# Altium project Power_Board_DRV8323.PrjPcb
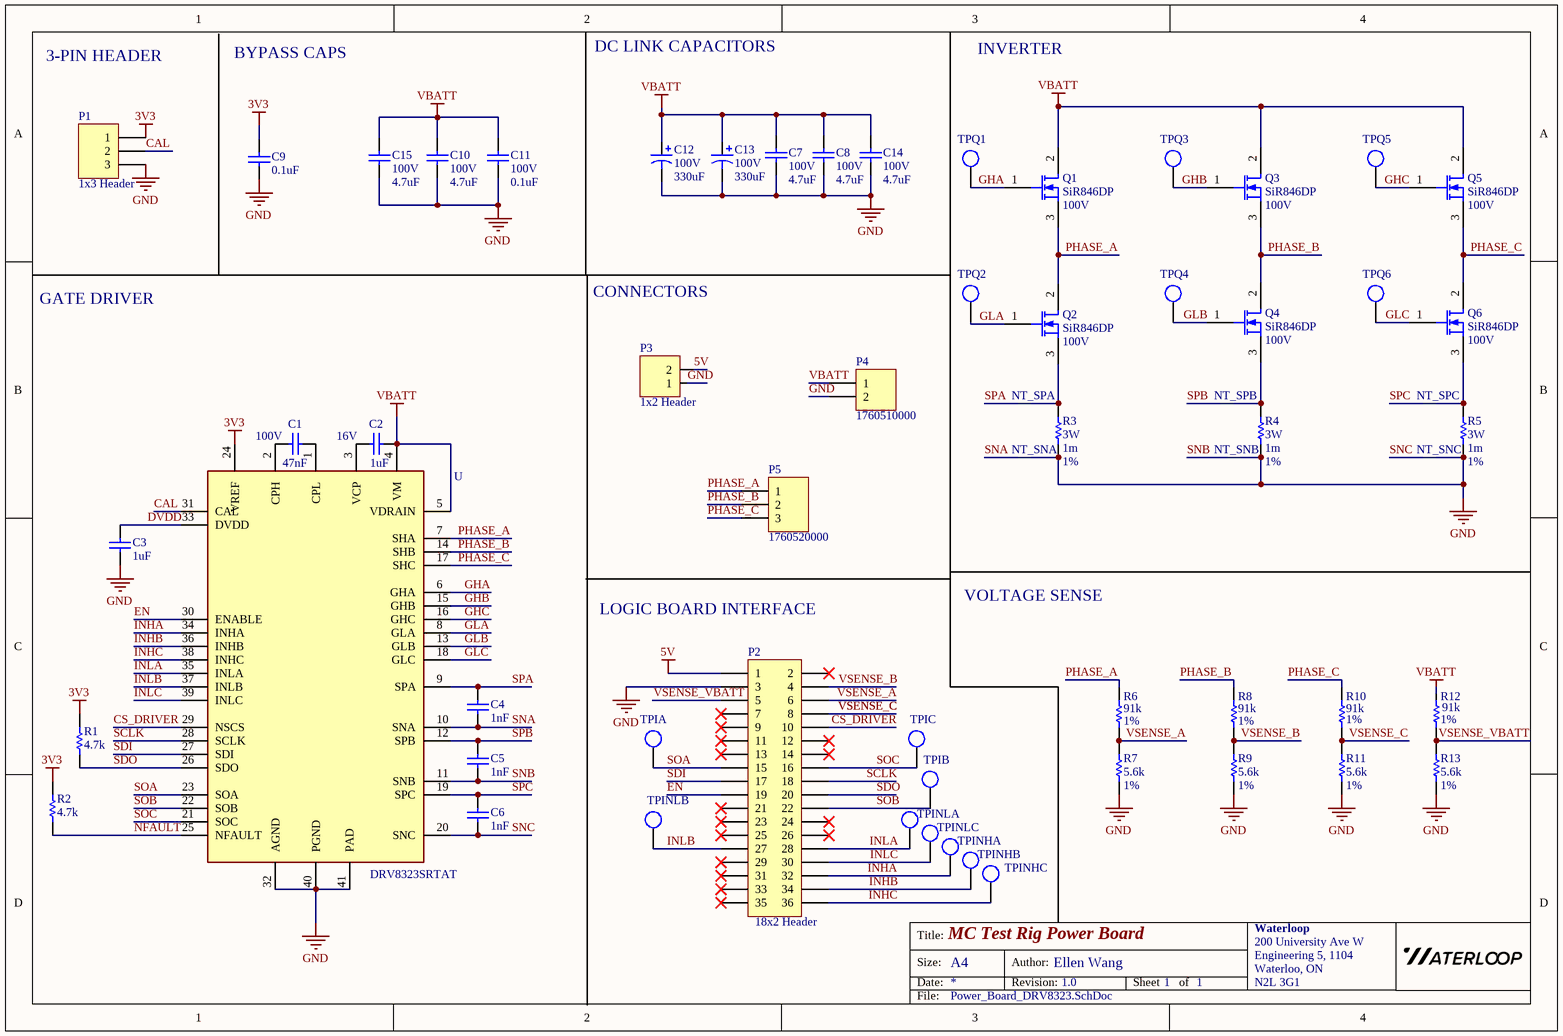
[diagram p0: Power_Board_DRV8323.SchDoc]
1 sheet, 61 parts. Net scope: global (net labels, ports and power ports of the same name join across sheets).
Board file: Power_Board_DRV8323.PcbDoc

## Sheet Power_Board_DRV8323.SchDoc: MC Test Rig Power Board
size A4; Author: Ellen Wang; Organization: Waterloop; Address1: 200 University Ave W; Address2: Engineering 5, 1104; Address3: Waterloo, ON; Address4: N2L 3G1; Revision: 1.0; SheetNumber: 1; SheetTotal: 1

### Parts
C1  value 47nF  Rating: 100V  [0805 - Capacitor]  (hidden comment: Capacitor - Nonpolarized)
C2  value 1uF  Rating: 16V  [0805 - Capacitor]  (hidden comment: Capacitor - Nonpolarized)
C3  value 1uF  [0805 - Capacitor]  (hidden comment: Capacitor - Nonpolarized)
C4  value 1nF  [0805 - Capacitor]  (hidden comment: Capacitor - Nonpolarized)
C5  value 1nF  [0805 - Capacitor]  (hidden comment: Capacitor - Nonpolarized)
C6  value 1nF  [0805 - Capacitor]  (hidden comment: Capacitor - Nonpolarized)
C7  value 4.7uF  Rating: 100V  [1210 - Capacitor]  (hidden comment: Capacitor - Nonpolarized)
C8  value 4.7uF  Rating: 100V  [1210 - Capacitor]  (hidden comment: Capacitor - Nonpolarized)
C9  value 0.1uF  [0805 - Capacitor]  (hidden comment: Capacitor - Nonpolarized)
C10  value 4.7uF  Rating: 100V  [1210 - Capacitor]  (hidden comment: Capacitor - Nonpolarized)
C11  value 0.1uF  Rating: 100V  [0805 - Capacitor]  (hidden comment: Capacitor - Nonpolarized)
C12  value 330uF  Rating: 100V  [OCVZ0606 - CAPACITOR]  (hidden comment: Capacitor - Polarized)
C13  value 330uF  Rating: 100V  [OCVZ0606 - CAPACITOR]  (hidden comment: Capacitor - Polarized)
C14  value 4.7uF  Rating: 100V  [1210 - Capacitor]  (hidden comment: Capacitor - Nonpolarized)
C15  value 4.7uF  Rating: 100V  [1210 - Capacitor]  (hidden comment: Capacitor - Nonpolarized)
NT_SNA  NetTie  [Net Tie]  (value not drawn)  (net tie, no BOM)
NT_SNB  NetTie  [Net Tie]  (value not drawn)  (net tie, no BOM)
NT_SNC  NetTie  [Net Tie]  (value not drawn)  (net tie, no BOM)
NT_SPA  NetTie  [Net Tie]  (value not drawn)  (net tie, no BOM)
NT_SPB  NetTie  [Net Tie]  (value not drawn)  (net tie, no BOM)
NT_SPC  NetTie  [Net Tie]  (value not drawn)  (net tie, no BOM)
P1  1x3 Header  [HDR1X3]
P2  Header 18X2  [HDR2X18]  (value not drawn)
P3  1x2 Header  [HDR1X2]
P4  1760510000  [1760510000]
P5  1760520000  [1760520000]
Q1  Supplier Part Number: SiR846DP  Rating: 100V  [PowerPAK® SO-8]  (hidden comment: MOSFET-N)
Q2  Supplier Part Number: SiR846DP  Rating: 100V  [PowerPAK® SO-8]  (hidden comment: MOSFET-N)
Q3  Supplier Part Number: SiR846DP  Rating: 100V  [PowerPAK® SO-8]  (hidden comment: MOSFET-N)
Q4  Supplier Part Number: SiR846DP  Rating: 100V  [PowerPAK® SO-8]  (hidden comment: MOSFET-N)
Q5  Supplier Part Number: SiR846DP  Rating: 100V  [PowerPAK® SO-8]  (hidden comment: MOSFET-N)
Q6  Supplier Part Number: SiR846DP  Rating: 100V  [PowerPAK® SO-8]  (hidden comment: MOSFET-N)
R1  value 4.7k  [0603 - Resistor]  (hidden comment: Resistor)
R2  value 4.7k  [0603 - Resistor]  (hidden comment: Resistor)
R3  value 1m  Rating: 3W  Tolerance: 1%  [2512 - RESISTOR]  (hidden comment: Resistor)
R4  value 1m  Rating: 3W  Tolerance: 1%  [2512 - RESISTOR]  (hidden comment: Resistor)
R5  value 1m  Rating: 3W  Tolerance: 1%  [2512 - RESISTOR]  (hidden comment: Resistor)
R6  value 91k  Tolerance: 1%  [0603 - Resistor]  (hidden comment: Resistor)
R7  value 5.6k  Tolerance: 1%  [0603 - Resistor]  (hidden comment: Resistor)
R8  value 91k  Tolerance: 1%  [0603 - Resistor]  (hidden comment: Resistor)
R9  value 5.6k  Tolerance: 1%  [0603 - Resistor]  (hidden comment: Resistor)
R10  value 91k  Tolerance: 1%  [0603 - Resistor]  (hidden comment: Resistor)
R11  value 5.6k  Tolerance: 1%  [0603 - Resistor]  (hidden comment: Resistor)
R12  value 91k  Tolerance: 1%  [0603 - Resistor]  (hidden comment: Resistor)
R13  value 5.6k  Tolerance: 1%  [0603 - Resistor]  (hidden comment: Resistor)
TPIA  Test Point  [Test Point]  (value not drawn)  (no BOM)
TPIB  Test Point  [Test Point]  (value not drawn)  (no BOM)
TPIC  Test Point  [Test Point]  (value not drawn)  (no BOM)
TPINHA  Test Point  [Test Point]  (value not drawn)  (no BOM)
TPINHB  Test Point  [Test Point]  (value not drawn)  (no BOM)
TPINHC  Test Point  [Test Point]  (value not drawn)  (no BOM)
TPINLA  Test Point  [Test Point]  (value not drawn)  (no BOM)
TPINLB  Test Point  [Test Point]  (value not drawn)  (no BOM)
TPINLC  Test Point  [Test Point]  (value not drawn)  (no BOM)
TPQ1  Test Point  [Test Point]  (value not drawn)  (no BOM)
TPQ2  Test Point  [Test Point]  (value not drawn)  (no BOM)
TPQ3  Test Point  [Test Point]  (value not drawn)  (no BOM)
TPQ4  Test Point  [Test Point]  (value not drawn)  (no BOM)
TPQ5  Test Point  [Test Point]  (value not drawn)  (no BOM)
TPQ6  Test Point  [Test Point]  (value not drawn)  (no BOM)
U  DRV8323SRTAT  [DRV8323SRTAT]

### Nets
3V3: C9.1 P1.1 R1.2 R2.2 U.24(VREF)
5V: P2.1 P3.2
GND: C3.1 C7.2 C8.2 C9.2 C10.2 C11.2 C12.2 C13.2 C14.2 C15.2 NT_SNA.2 NT_SNB.2 NT_SNC.2 P1.3 P2.3 P3.1 P4.2 R3.1 R4.1 R5.1 R7.2 R9.2 R11.2 R13.2 U.32(AGND) U.40(PGND) U.41(PAD)
VBATT: C2.2 C7.1 C8.2 C10.2 C11.2 C12.1 C13.1 C14.2 C15.2 P4.1 Q1.2(D) Q3.2(D) Q5.2(D) R12.1 U.4(VM) U.5(VDRAIN)
CAL: P1.2 U.31(CAL)
CS_DRIVER: P2.10 U.29(NSCS)
DVDD: C3.2 U.33(DVDD)
EN: P2.19 U.30(ENABLE)
GHA: Q1.1(G) TPQ1.1 U.6(GHA)
GHB: Q3.1(G) TPQ3.1 U.15(GHB)
GHC: Q5.1(G) TPQ5.1 U.16(GHC)
GLA: Q2.1(G) TPQ2.1 U.8(GLA)
GLB: Q4.1(G) TPQ4.1 U.13(GLB)
GLC: Q6.1(G) TPQ6.1 U.18(GLC)
INHA: P2.32 TPINHA.1 U.34(INHA)
INHB: P2.34 TPINHB.1 U.36(INHB)
INHC: P2.36 TPINHC.1 U.38(INHC)
INLA: P2.28 TPINLA.1 U.35(INLA)
INLB: P2.27 TPINLB.1 U.37(INLB)
INLC: P2.30 TPINLC.1 U.39(INLC)
NFAULT: R2.1 U.25(NFAULT)
PHASE_A: P5.1 Q1.3(S) Q2.2(D) R6.1 U.7(SHA)
PHASE_B: P5.2 Q3.3(S) Q4.2(D) R8.1 U.14(SHB)
PHASE_C: P5.3 Q5.3(S) Q6.2(D) R10.1 U.17(SHC)
SCLK: P2.18 U.28(SCLK)
SDI: P2.17 U.27(SDI)
SDO: P2.20 R1.1 U.26(SDO)
SNA: C4.1 NT_SNA.1 U.10(SNA)
SNB: C5.1 NT_SNB.1 U.11(SNB)
SNC: C6.1 NT_SNC.1 U.20(SNC)
SOA: P2.15 TPIA.1 U.23(SOA)
SOB: P2.22 TPIB.1 U.22(SOB)
SOC: P2.16 TPIC.1 U.21(SOC)
SPA: C4.2 NT_SPA.1 U.9(SPA)
SPB: C5.2 NT_SPB.1 U.12(SPB)
SPC: C6.2 NT_SPC.1 U.19(SPC)
VSENSE_A: P2.6 R6.2 R7.1
VSENSE_B: P2.4 R8.2 R9.1
VSENSE_C: P2.8 R10.2 R11.1
VSENSE_VBATT: P2.5 R12.2 R13.1
NetC1_1: C1.1 U.2(CPH)
NetC1_2: C1.2 U.1(CPL)
NetC2_1: C2.1 U.3(VCP)
NetNT_SPA_2: NT_SPA.2 Q2.3(S) R3.2
NetNT_SPB_2: NT_SPB.2 Q4.3(S) R4.2
NetNT_SPC_2: NT_SPC.2 Q6.3(S) R5.2

Not connected (* = marked no-connect by the designer): P2 2* 7* 9* 11* 12* 13* 14* 21* 23* 24* 25* 26* 29* 31* 33* 35*

### Notes on the sheet
- 3-PIN HEADER
- BYPASS CAPS
- DC LINK CAPACITORS
- INVERTER
- GATE DRIVER
- CONNECTORS
- LOGIC BOARD INTERFACE
- VOLTAGE SENSE
- (near P2) 18x2 Header
- Title:
- Size:
- Date:
- A4
- Author:
- Revision:
- Sheet
- of
- File:

### Library data of the parts
C1 = Capacitor - Nonpolarized: Nonpolarized Capacitor; Manufacturer: YAGEO; Manufacturer Part Number: CC0805KKX7R0BB473; Supplier Part Number: 311-1876-1-ND; Supplier: Digikey
C2 = Capacitor - Nonpolarized: Nonpolarized Capacitor; Manufacturer: YAGEO; Manufacturer Part Number: CC0805KKX7R7BB105; Supplier Part Number: 311-1365-1-ND; Supplier: Digikey; Parameter 1: *
C3 = Capacitor - Nonpolarized: Nonpolarized Capacitor; Manufacturer: YAGEO; Manufacturer Part Number: CC0805KKX7R7BB105; Rating: 16V; Supplier Part Number: 311-1365-1-ND; Supplier: Digikey
C4-C6 = Capacitor - Nonpolarized: Nonpolarized Capacitor; Manufacturer: YAGEO; Manufacturer Part Number: CC0805KRX7R0BB102; Rating: 100V; Supplier Part Number: 311-1472-1-ND; Supplier: Digikey
C7 C8 C10 C14 C15 = Capacitor - Nonpolarized: Nonpolarized Capacitor; Manufacturer: Holy Stone Enterprise Co., Ltd.; Manufacturer Part Number: C1210X475K101T; Supplier Part Number: 2873-C1210X475K101TCT-ND; Supplier: Digikey
C9 = Capacitor - Nonpolarized: Nonpolarized Capacitor; Manufacturer: Samsung Electro-Mechanics; Manufacturer Part Number: CL21B104KCFWPNE; Rating: 100V; Supplier Part Number: 1276-6733-1-ND; Supplier: Digikey
C11 = Capacitor - Nonpolarized: Nonpolarized Capacitor; Manufacturer: Samsung Electro-Mechanics; Manufacturer Part Number: CL21B104KCFWPNE; Supplier Part Number: 1276-6733-1-ND; Supplier: Digikey
C12 C13 = Capacitor - Polarized: Polarized Capacitor; Manufacturer: Panasonic Electronic Components; Manufacturer Part Number: EEE-FK2A331AM; Supplier: Digikey; Supplier Part Number: PCE4867CT-ND
NT_SNA NT_SNB NT_SNC NT_SPA NT_SPB NT_SPC = Net Tie
P1 = 1x3 Header: 1x3 Pin Header
P2 = Header 18X2: Header, 18-Pin, Dual row; LatestRevisionDate: 17-Jul-2002; LatestRevisionNote: Re-released for DXP Platform.; Publisher: Altium Limited
P3 = 1x2 Header: 1x2 Pin Header
P4 = 1760510000: 1x2 Screw Terminal Block; Manufacturer Part Number: OSTTC022162; Manufacturer: On Shore Technology Inc.; Supplier Part Number: ED2609-ND; Supplier: Digikey; ComponentLink1Description: Datasheet; ComponentLink1URL: http://www.on-shore.com/wp-content/uploads/OSTTCXX2162.pdf
P5 = 1760520000: 1x3 Screw Terminal Block; Manufacturer Part Number: 282857-3; Manufacturer: TE Connectivity AMP Connectors; Supplier: Digikey; Supplier Part Number: A98360-ND; ComponentLink1Description: Datasheet; ComponentLink1URL: https://media.digikey.com/pdf/Data%20Sheets/Weidmuller%20PDFs/1760520000.pdf
Q1-Q6 = MOSFET-N: N-Channel MOSFET; Supplier: *; Manufacturer Part Number: *; Manufacturer: *; Value: *
R1 R2 = Resistor: Manufacturer Part Number: RC0603FR-074K7L; Manufacturer: YAGEO; Rating: *; Supplier Part Number: 311-4.70KHRCT-ND; Supplier: Digikey
R3-R5 = Resistor: Manufacturer Part Number: CSR2512C0R001F; Manufacturer: Riedon; Supplier Part Number: 696-1185-1-ND; Supplier: Digikey
R6 R8 R10 R12 = Resistor: Manufacturer Part Number: RC0603FR-0791KL; Manufacturer: YAGEO; Supplier Part Number: 311-91.0KHRCT-ND; Supplier: Digikey
R7 R9 R11 R13 = Resistor: Manufacturer Part Number: RC0603FR-075K6L; Manufacturer: YAGEO; Rating: *; Supplier Part Number: 311-5.60KHRCT-ND; Supplier: Digikey
U = DRV8323SRTAT: Multiphase Motor Driver Power MOSFET SPI; Manufacturer: Texas Instruments; Manufacturer Part Number: DRV8323SRTAT; Supplier: Digikey; Supplier Part Number: 296-47095-1-ND; ComponentLink1Description: Datasheet; ComponentLink1URL: https://www.ti.com/lit/ds/symlink/drv8323.pdf?HQS=dis-dk-null-digikeymode-dsf-pf-null-wwe&ts=1623708117864